# Altium schematic sheet Rear Motors.SchDoc
size A3; SheetNumber: 4; SheetTotal: 8
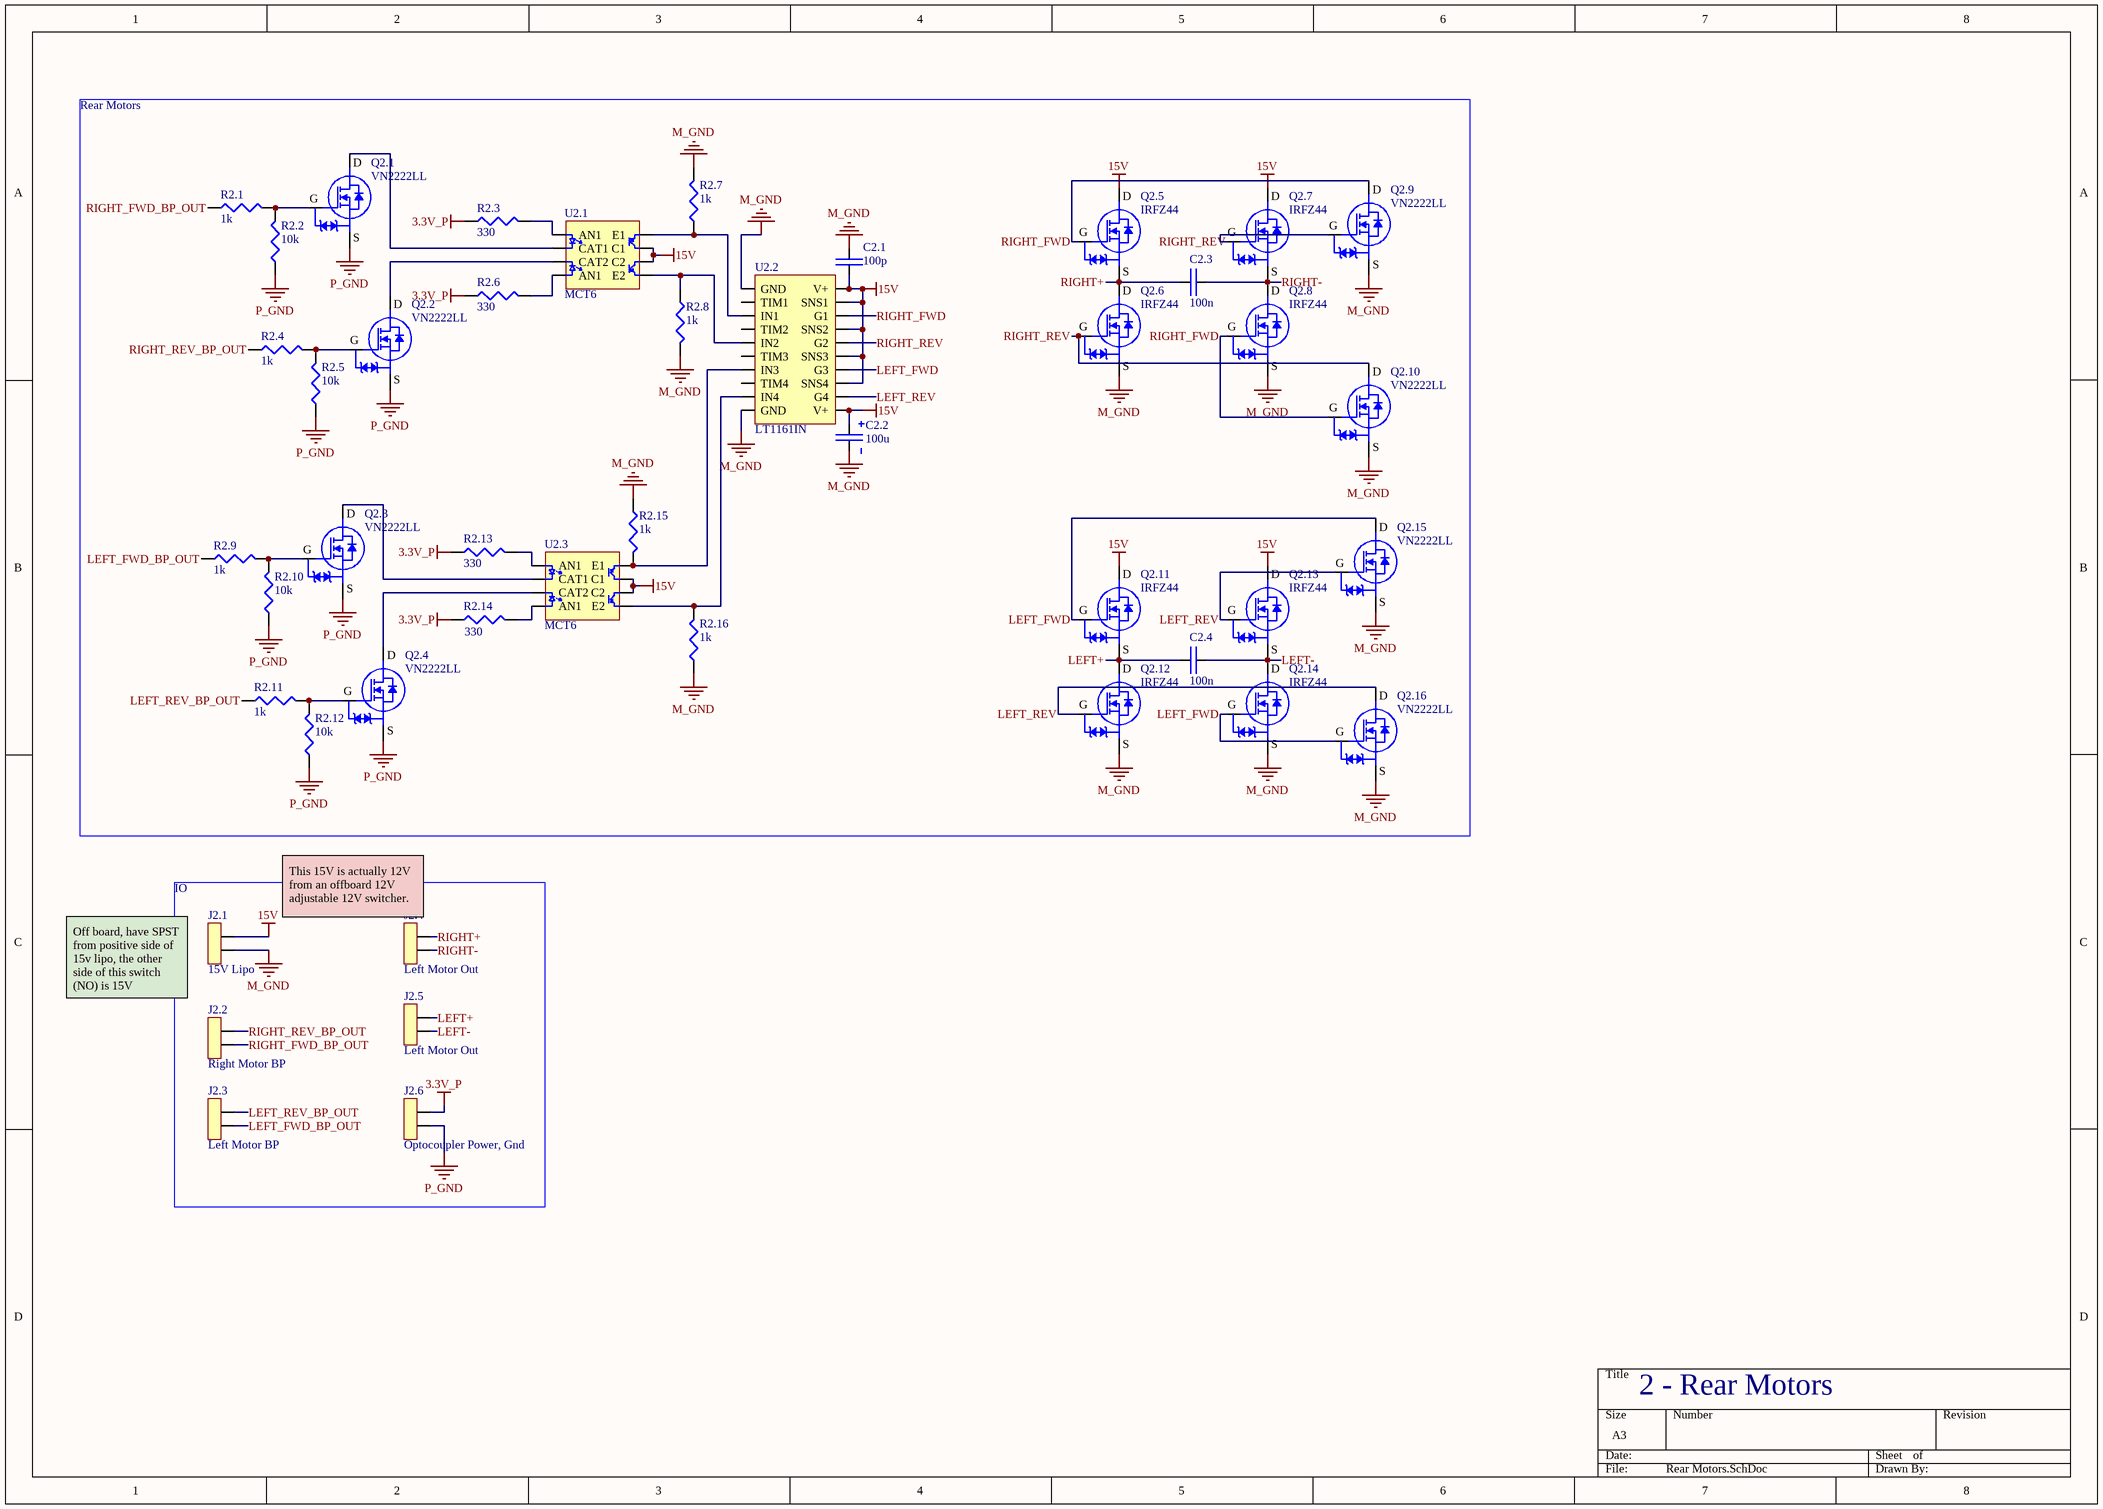
[diagram p0: Rear Motors.SchDoc]

## Parts
C2.1  100p  [Non Polarized Cap]
C2.2  100u  [Polarized Cap]
C2.3  100n  [Non Polarized Cap]
C2.4  100n  [Non Polarized Cap]
J2.1  15V Lipo  [2pos JST]
J2.2  Right Motor BP  [2pos JST]
J2.3  Left Motor BP  [2pos JST]
J2.4  Left Motor Out  [2pos JST]
J2.5  Left Motor Out  [2pos JST]
J2.6  Optocoupler Power, Gnd  [2pos JST]
Q2.1  VN2222LL  [VN2222LL]
Q2.2  VN2222LL  [VN2222LL]
Q2.3  VN2222LL  [VN2222LL]
Q2.4  VN2222LL  [VN2222LL]
Q2.5  IRFZ44  [TO220]
Q2.6  IRFZ44  [TO220]
Q2.7  IRFZ44  [TO220]
Q2.8  IRFZ44  [TO220]
Q2.9  VN2222LL  [VN2222LL]
Q2.10  VN2222LL  [VN2222LL]
Q2.11  IRFZ44  [TO220]
Q2.12  IRFZ44  [TO220]
Q2.13  IRFZ44  [TO220]
Q2.14  IRFZ44  [TO220]
Q2.15  VN2222LL  [VN2222LL]
Q2.16  VN2222LL  [VN2222LL]
R2.1  1k  [Res_Generic]
R2.2  10k  [Res_Generic]
R2.3  330  [Res_Generic]
R2.4  1k  [Res_Generic]
R2.5  10k  [Res_Generic]
R2.6  330  [Res_Generic]
R2.7  1k  [Res_Generic]
R2.8  1k  [Res_Generic]
R2.9  1k  [Res_Generic]
R2.10  10k  [Res_Generic]
R2.11  1k  [Res_Generic]
R2.12  10k  [Res_Generic]
R2.13  330  [Res_Generic]
R2.14  330  [Res_Generic]
R2.15  1k  [Res_Generic]
R2.16  1k  [Res_Generic]
U2.1  MCT6  [DIP8]
U2.2  LT1161IN  [DIP20]
U2.3  MCT6  [DIP8]

## Blocks framed on the sheet
Rear Motors: C2.1-C2.4 Q2.1-Q2.16 R2.1-R2.16 U2.1-U2.3
IO: J2.1-J2.6

## Nets
3.3V_P: J2.6.2 R2.3.1 R2.6.1 R2.13.1 R2.14.1
15V: C2.1.1 C2.2.1 J2.1.2 Q2.5.2(D) Q2.7.2(D) Q2.11.2(D) Q2.13.2(D) U2.1.6(C2) U2.1.7(C1) U2.2.11(V+) U2.2.13(SNS4) U2.2.15(SNS3) U2.2.17(SNS2) U2.2.19(SNS1) U2.2.20(V+) U2.3.6(C2) U2.3.7(C1)
M_GND: C2.1.2 C2.2.2 J2.1.1 Q2.6.3(S) Q2.8.3(S) Q2.9.1(S) Q2.10.1(S) Q2.12.3(S) Q2.14.3(S) Q2.15.1(S) Q2.16.1(S) R2.7.2 R2.8.2 R2.15.1 R2.16.1 U2.2.1(GND) U2.2.10(GND)
P_GND: J2.6.1 Q2.1.1(S) Q2.2.1(S) Q2.3.1(S) Q2.4.1(S) R2.2.1 R2.5.1 R2.10.1 R2.12.1
LEFT+: C2.4.1 J2.5.2 Q2.11.3(S) Q2.12.2(D)
LEFT-: C2.4.2 J2.5.1 Q2.13.3(S) Q2.14.2(D)
LEFT_FWD: Q2.11.1(G) Q2.14.1(G) Q2.15.3(D) Q2.16.2(G) U2.2.14(G3)
LEFT_FWD_BP_OUT: J2.3.1 R2.9.1
LEFT_REV: Q2.12.1(G) Q2.13.1(G) Q2.15.2(G) Q2.16.3(D) U2.2.12(G4)
LEFT_REV_BP_OUT: J2.3.2 R2.11.1
RIGHT+: C2.3.1 J2.4.2 Q2.5.3(S) Q2.6.2(D)
RIGHT-: C2.3.2 J2.4.1 Q2.7.3(S) Q2.8.2(D)
RIGHT_FWD: Q2.5.1(G) Q2.8.1(G) Q2.9.3(D) Q2.10.2(G) U2.2.18(G1)
RIGHT_FWD_BP_OUT: J2.2.1 R2.1.1
RIGHT_REV: Q2.6.1(G) Q2.7.1(G) Q2.9.2(G) Q2.10.3(D) U2.2.16(G2)
RIGHT_REV_BP_OUT: J2.2.2 R2.4.1
NetQ2.1_2: Q2.1.2(G) R2.1.2 R2.2.2
NetQ2.1_3: Q2.1.3(D) U2.1.2(CAT1)
NetQ2.2_2: Q2.2.2(G) R2.4.2 R2.5.2
NetQ2.2_3: Q2.2.3(D) U2.1.3(CAT2)
NetQ2.3_2: Q2.3.2(G) R2.9.2 R2.10.2
NetQ2.3_3: Q2.3.3(D) U2.3.2(CAT1)
NetQ2.4_2: Q2.4.2(G) R2.11.2 R2.12.2
NetQ2.4_3: Q2.4.3(D) U2.3.3(CAT2)
NetR2.3_2: R2.3.2 U2.1.1(AN1)
NetR2.6_2: R2.6.2 U2.1.4(AN1)
NetR2.7_1: R2.7.1 U2.1.8(E1) U2.2.3(IN1)
NetR2.8_1: R2.8.1 U2.1.5(E2) U2.2.5(IN2)
NetR2.13_2: R2.13.2 U2.3.1(AN1)
NetR2.14_2: R2.14.2 U2.3.4(AN1)
NetR2.15_2: R2.15.2 U2.2.7(IN3) U2.3.8(E1)
NetR2.16_2: R2.16.2 U2.2.9(IN4) U2.3.5(E2)

Not connected (* = marked no-connect by the designer): U2.2 2(TIM1) 4(TIM2) 6(TIM3) 8(TIM4)

## Notes on the sheet
- (near J2.4) This 15V is actually 12V from an offboard 12V adjustable 12V switcher.
- Off board, have SPST from positive side of 15v lipo, the other side of this switch (NO) is 15V
- 2 - Rear Motors

## Library data of the parts
C2.1 C2.3 C2.4 = Cap_Generic
C2.2 = Polarized Cap
J2.1-J2.6 = 2pos Conn: 2pos Conn JST
Q2.1-Q2.4 Q2.9 Q2.10 Q2.15 Q2.16 = VN2222LL NMOS: VN2222LL N-Channel 60 V 150mA 400mW Through Hole TO-92 (TO-226); Supplier 1: Mouser; Supplier Part Number 1: 689-VN2222LL-G
Q2.5-Q2.8 Q2.11-Q2.14 = IRFZ44 NMOS: IRFZ44EPBF N-Channel 60 V 48A 110W Through Hole TO-220AB; Supplier 1: Digi-Key; Supplier Part Number 1: IRFZ44ZLPBF-ND
R2.1-R2.16 = Res_Generic
U2.1 U2.3 = MCT6 Optocoupler: Optoisolator 5.3KV 2CH TRANS 8-DIP; Supplier 1: Mouser; Supplier Part Number 1: 512-MCT6
U2.2 = LT1161IN Gate Driver: LT1161IN High-Side Gate Driver IC Non-Inverting 20-PDIP; Supplier 1: Digi-Key; Supplier Part Number 1: LT1161IN#PBF-ND